# Altium schematic sheet ADC.SchDoc
size 420 x 297 mm; SheetNumber: 3; SheetTotal: 5
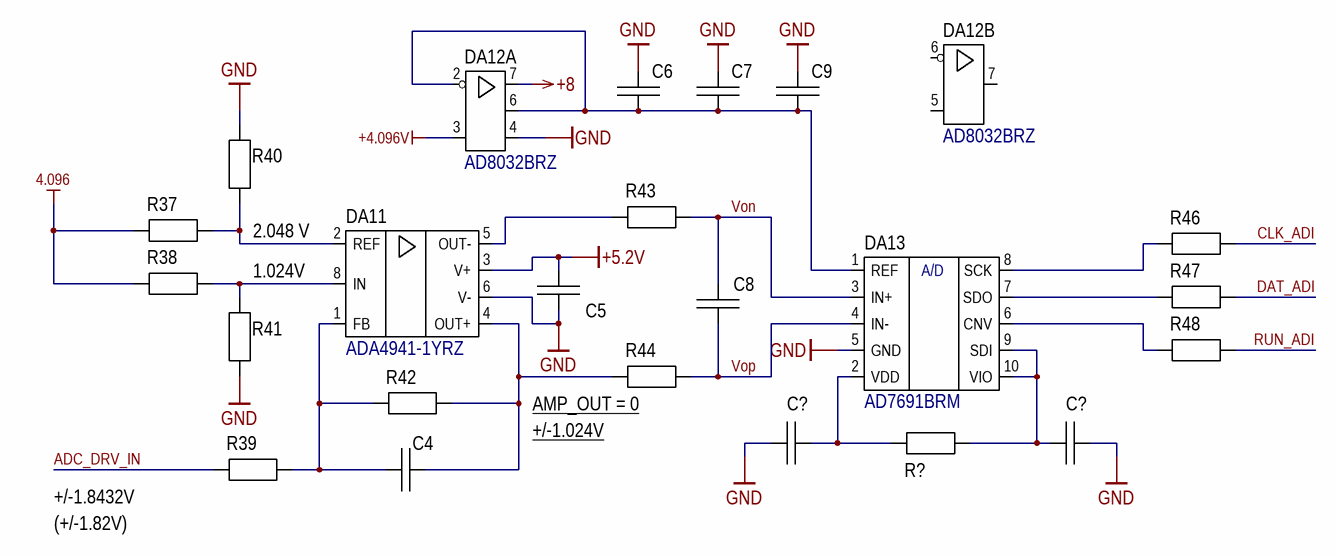
[diagram p0: ADC.SchDoc]

## Parts
(Parts that share a designator on the sheet are numbered #1, #2 ... from top to bottom, then left to right.)
C4  0805-C0G-50 В-240 пФ +-5%  [CAP: 0805]  (value not drawn)
C5  1206-X7R-50 B-0,1 мкФ+-10%  [CAP: 1206]  (value not drawn)
C6  0805-X5R-25 В-10 мкФ +-10%  [CAP: 0805]  (value not drawn)
C7  1206-X7R-50 B-2,2 мкФ+-10%  [CAP: 1206]  (value not drawn)
C8  1206-X7R-50 B-0,01 мкФ+-10%  [CAP: 1206]  (value not drawn)
C9  1206-X7R-50 B-2,2 мкФ+-10%  [CAP: 1206]  (value not drawn)
C?#1  1206-X7R-50 B-2,2 мкФ+-10%  [CAP: 1206]  (value not drawn)
C?#2  1206-X7R-50 B-0,33 мкФ+-10%  [CAP: 1206]  (value not drawn)
DA11  ADA4941-1YRZ  [8-SOIC]
DA12  AD8032BRZ  [8-SOIC]  (parts A,B of 2)
DA13  AD7691BRM  [10-MSOP]
R37  0805-1 кОм+-0,1%  [0805]  (value not drawn)
R38  0805-1 кОм+-0,1%  [0805]  (value not drawn)
R39  0805-1 кОм+-0,1%  [0805]  (value not drawn)
R40  0805-1 кОм+-0,1%  [0805]  (value not drawn)
R41  0805-332 Ом+-0,1%  [0805]  (value not drawn)
R42  0805-1 кОм+-0,1%  [0805]  (value not drawn)
R43  1206-51 Ом+-5%  [1206]  (value not drawn)
R44  1206-51 Ом+-5%  [1206]  (value not drawn)
R46  1206-33 Ом+-5%  [1206]  (value not drawn)
R47  1206-33 Ом+-5%  [1206]  (value not drawn)
R48  1206-33 Ом+-5%  [1206]  (value not drawn)
R?  1206-10 Ом+-5%  [1206]  (value not drawn)

## Nets
4.096: R37.1 R38.1
+4.096V: DA12.3(+IN)
+5.2V: C5.1 DA11.3(V+)
+8: DA12.7(Vs+)
GND: C5.2 C6.2 C7.2 C9.2 C?#1.1 C?#2.2 DA11.6(V-) DA12.4(Vs-) DA13.5(GND) R40.2 R41.1
ADC_DRV_IN: R39.1
CLK_ADI: R46.2
DAT_ADI: R47.2
RUN_ADI: R48.2
Von: C8.2 DA13.3(IN+) R43.2
Vop: C8.1 DA13.4(IN-) R44.2
NetC4_1: C4.1 DA11.1(FB) R39.2 R42.1
NetC4_2: C4.2 DA11.4(OUT+) R42.2 R44.1
NetC6_1: C6.1 C7.1 C9.1 DA12.2(-IN) DA12.6(OUT) DA13.1(REF)
NetC?#1_2: C?#1.2 DA13.2(VDD) R?.1
NetC?#2_1: C?#2.1 DA13.9(SDI) DA13.10(VIO) R?.2
NetDA11_2: DA11.2(REF) R37.2 R40.1
NetDA11_5: DA11.5(OUT-) R43.1
NetDA11_8: DA11.8(IN) R38.2 R41.2
NetDA13_6: DA13.6(CNV) R48.1
NetDA13_7: DA13.7(SDO) R47.1
NetDA13_8: DA13.8(SCK) R46.1

Not connected (* = marked no-connect by the designer): DA12 5(+IN)

## Notes on the sheet
- 2.048 V
- 1.024V
- (near R44) +/-1.024V
- (near R44) AMP_OUT = 0
- +/-1.8432V
- (+/-1.82V)
- Подп. дата
- Инв. № дубл.
- Взам. инв. №
- Подп. и дата
- Инв. № подл.
- Изм.
- Лист
- № докум.
- Подп.
- Дата
- ALTIUM GOSTBOM2.0 KEV
- Файл:
- Копировал
- Формат А3
- (in symbol AD7691BRM) A/D

## Library data of the parts
C4 = 0805-C0G-50 В-240 пФ +-5%: Value: 10 пФ
C5 = 1206-X7R-50 B-0,1 мкФ+-10%: Value: 0,1 мкФ
C6 = 0805-X5R-25 В-10 мкФ +-10%: Value: 10 мкФ
C7 C9 C?#1 = 1206-X7R-50 B-2,2 мкФ+-10%: Value: 2,2 мкФ
DA11 = ADA4941-1YRZ: Single-Supply, Differential, 18-Bit ADC Driver
DA12 = AD8032BRZ: Rail-to-Rail I/O Amplifiers 2.7 V, 800 μA, 80 MHz
R37-R40 R42 = 0805-1 кОм+-0,1%: Value: 1 кОм; ModelPrint: 0805
R41 = 0805-332 Ом+-0,1%: Value: 332 Ом; ModelPrint: 0805
R43 R44 = 1206-51 Ом+-5%: Value: 51 Ом; ModelPrint: 1206
R46-R48 = 1206-33 Ом+-5%: Value: 33 Ом; ModelPrint: 1206
R? = 1206-10 Ом+-5%: Value: 10 Ом; ModelPrint: 1206
C8 = 1206-X7R-50 B-0,01 мкФ+-10%: Value: 0,01 мкФ
C?#2 = 1206-X7R-50 B-0,33 мкФ+-10%: Value: 0,33 мкФ